# EAGLE design HeadsetR1 (EAGLE 6.4)
ECE477 Senior Design Project Augmented Reality Simulator board utilizing STM32F4 and Raspberry PI
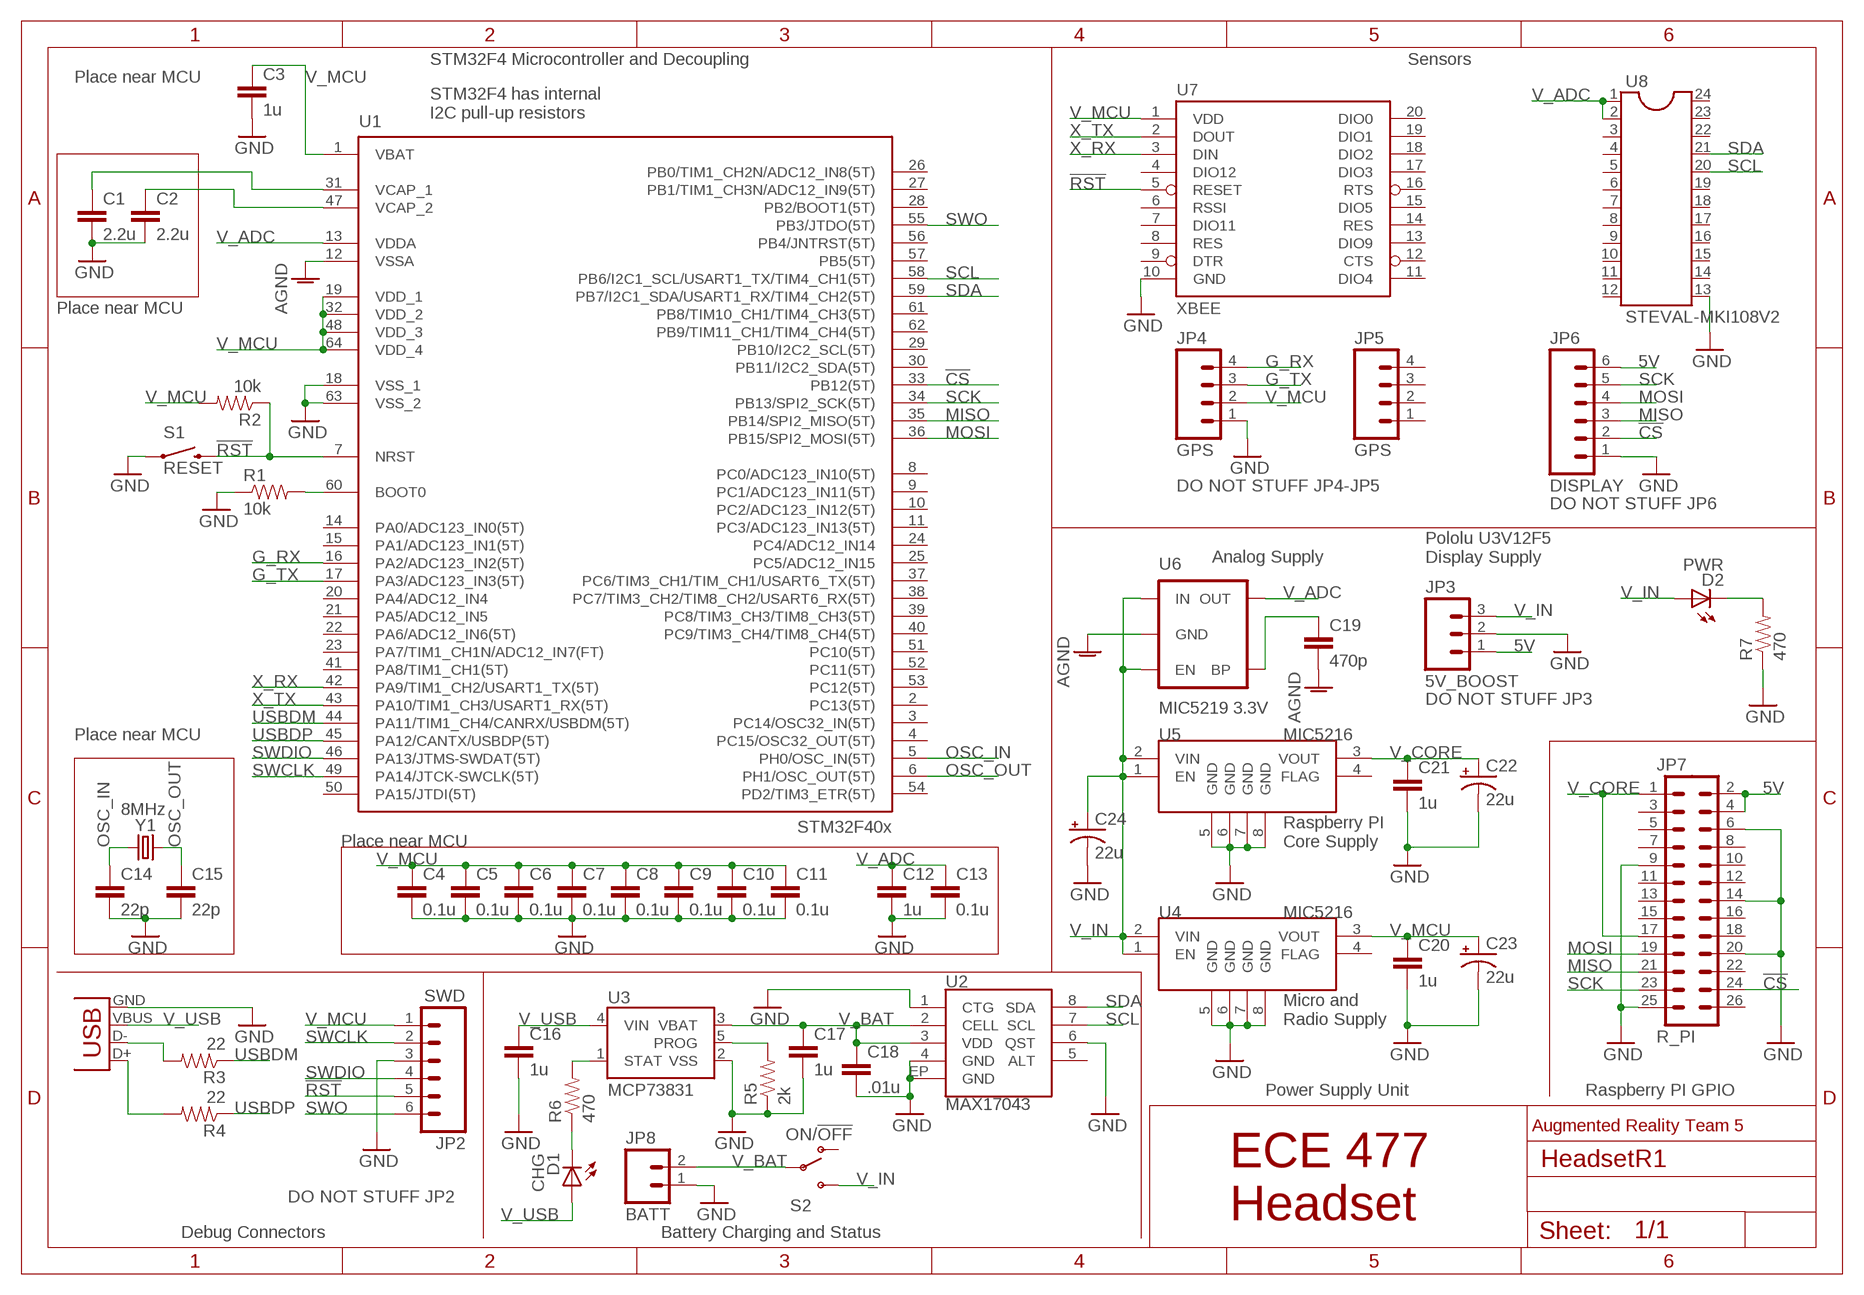
[diagram p0: schematic, sheet 1]

## Parts
C1  2.2u  CAP0805  [0805]
C2  2.2u  CAP0805  [0805]
C3  1u  CAP0805  [0805]
C4  0.1u  CAP0805  [0805]
C5  0.1u  CAP0805  [0805]
C6  0.1u  CAP0805  [0805]
C7  0.1u  CAP0805  [0805]
C8  0.1u  CAP0805  [0805]
C9  0.1u  CAP0805  [0805]
C10  0.1u  CAP0805  [0805]
C11  0.1u  CAP0805  [0805]
C12  1u  CAP0805  [0805]
C13  0.1u  CAP0805  [0805]
C14  22p  CAP0805  [0805]
C15  22p  CAP0805  [0805]
C16  1u  CAP0805  [0805]
C17  1u  CAP0805  [0805]
C18  .01u  CAP0805  [0805]
C19  470p  CAP0805  [0805]
C20  1u  CAP0805  [0805]
C21  1u  CAP0805  [0805]
C22  22u  CAP_POLVISHAY_D  [VISHAY_D]
C23  22u  CAP_POLVISHAY_D  [VISHAY_D]
C24  22u  CAP_POLVISHAY_D  [VISHAY_D]
D1  CHG  LED-RED1206  [LED-1206]
D2  PWR  LED-RED1206  [LED-1206]
JP1  USBSMD  [USB-MINIB]
JP2  SWD  M06SIP  [1X06]
JP3  5V_BOOST  M03PTH  [1X03]
JP4  GPS  M04PTH  [1X04]
JP5  GPS  M04PTH  [1X04]
JP6  DISPLAY  M06SIP  [1X06]
JP7  R_PI  M13X22X13  [2X13]
JP8  BATT  M02JST-PTH-2  [JST-2-PTH]
R1  10k  RES  [0805]
R2  10k  RES  [0805]
R3  22  RES  [0805]
R4  22  RES  [0805]
R5  2k  RES  [0805]
R6  470  RES  [0805]
R7  470  RES  [0805]
S1  RESET  SWITCH-MOMENTARY-2PTH  [TACTILE-PTH]
S2  ON/!OFF!  SWITCH-SPDTPTH  [SWITCH-SPDT]
U1  STM32F405RGT6  STM32F405R  [TQFP64]
U2  MAX17043  MAX1704X  [TDFN-8]
U3  MCP73831  [SOT23-5]
U4  MIC5216  V_REG_MIC5216  [MSOP8]
U5  MIC5216  V_REG_MIC5216  [MSOP8]
U6  MIC5219 3.3V  V_REG_MIC52193.3V  [SOT23-5]
U7  XBEE  XBEE-1B1  [XBEE-1]
U8  STEVAL-MKI108V2  DIL24-6  [DIL24-6]
Y1  8MHz  CRYSTALSMD  [HC49UP]

## Nets
5V: JP3.1 JP6.6 JP7.2 JP7.4
!CS!: JP6.2 JP7.24 U1.33(PB12(5T))
!RST!: JP2.5 R2.1 S1.3 U1.7(NRST) U7.5(RESET)
AGND: C19.2 U1.12(VSSA) U6.2(GND)
BC_PROG: R5.2 U3.5(PROG)
BC_STAT: R6.2 U3.1(STAT)
BC_STAT_LED: D1.C R6.1
BOOT0: R1.2 U1.60(BOOT0)
G_RX: JP4.4 U1.16(PA2/ADC123_IN2(5T))
G_TX: JP4.3 U1.17(PA3/ADC123_IN3(5T))
GND: C1.2 C2.2 C3.2 C4.2 C5.2 C6.2 C7.2 C8.2 C9.2 C10.2 C11.2 C12.2 C13.2 C14.2 C15.2 C16.2 C17.2 C18.2 C20.2 C21.2 C22.- C23.- C24.- JP1.GND JP2.3 JP3.2 JP4.1 JP6.1 JP7.6 JP7.9 JP7.14 JP7.20 JP7.25 JP8.1 R1.1 R5.1 R7.1 S1.1 U1.18(VSS_1) U1.63(VSS_2) U2.1(CTG) U2.4(GND) U2.6(QST) U2.EP(GND) U3.2(VSS) U4.5(GND) U4.6(GND) U4.7(GND) U4.8(GND) U5.5(GND) U5.6(GND) U5.7(GND) U5.8(GND) U7.10(GND) U8.13
MISO: JP6.3 JP7.21 U1.35(PB14/SPI2_MISO(5T))
MOSI: JP6.4 JP7.19 U1.36(PB15/SPI2_MOSI(5T))
OSC_IN: C14.1 U1.5(PH0/OSC_IN(5T)) Y1.1
OSC_OUT: C15.1 U1.6(PH1/OSC_OUT(5T)) Y1.2
PWR_LED: D2.C R7.2
SCK: JP6.5 JP7.23 U1.34(PB13/SPI2_SCK(5T))
SCL: U1.58(PB6/I2C1_SCL/USART1_TX/TIM4_CH1(5T)) U2.7(SCL) U8.20
SDA: U1.59(PB7/I2C1_SDA/USART1_RX/TIM4_CH2(5T)) U2.8(SDA) U8.21
SWCLK: JP2.2 U1.49(PA14/JTCK-SWCLK(5T))
SWDIO: JP2.4 U1.46(PA13/JTMS-SWDAT(5T))
SWO: JP2.6 U1.55(PB3/JTDO(5T))
USB_D+: JP1.D+ R4.2
USB_D-: JP1.D- R3.2
USBDM: R3.1 U1.44(PA11/TIM1_CH4/CANRX/USBDM(5T))
USBDP: R4.1 U1.45(PA12/CANTX/USBDP(5T))
V_ADC: C12.1 C13.1 U1.13(VDDA) U6.5(OUT) U8.1 U8.2
V_BAT: C17.1 C18.1 JP8.2 S2.2(P) U2.2(CELL) U2.3(VDD) U3.3(VBAT)
V_BYP: C19.1 U6.4(BP)
V_CORE: C21.1 C22.+ JP7.1 JP7.17 U5.3(VOUT)
V_IN: C24.+ D2.A JP3.3 S2.3(S) U4.1(EN) U4.2(VIN) U5.1(EN) U5.2(VIN) U6.1(IN) U6.3(EN)
V_MCU: C3.1 C4.1 C5.1 C6.1 C7.1 C8.1 C9.1 C10.1 C11.1 C20.1 C23.+ JP2.1 JP4.2 R2.2 U1.1(VBAT) U1.19(VDD_1) U1.32(VDD_2) U1.48(VDD_3) U1.64(VDD_4) U4.3(VOUT) U7.1(VDD)
V_USB: C16.1 D1.A JP1.VBUS U3.4(VIN)
VCAP1: C1.1 U1.31(VCAP_1)
VCAP2: C2.1 U1.47(VCAP_2)
X_RX: U1.42(PA9/TIM1_CH2/USART1_TX(5T)) U7.3(DIN)
X_TX: U1.43(PA10/TIM1_CH3/USART1_RX(5T)) U7.2(DOUT)
Unconnected: JP5.1 JP5.2 JP5.3 JP5.4 JP7.3 JP7.5 JP7.7 JP7.8 JP7.10 JP7.11 JP7.12 JP7.13 JP7.15 JP7.16 JP7.18 JP7.22 JP7.26 S2.1(O) U1.2(PC13(5T)) U1.3(PC14/OSC32_IN(5T)) U1.4(PC15/OSC32_OUT(5T)) U1.8(PC0/ADC123_IN10(5T)) U1.9(PC1/ADC123_IN11(5T)) U1.10(PC2/ADC123_IN12(5T)) U1.11(PC3/ADC123_IN13(5T)) U1.14(PA0/ADC123_IN0(5T)) U1.15(PA1/ADC123_IN1(5T)) U1.20(PA4/ADC12_IN4) U1.21(PA5/ADC12_IN5) U1.22(PA6/ADC12_IN6(5T)) U1.23(PA7/TIM1_CH1N/ADC12_IN7(FT)) U1.24(PC4/ADC12_IN14) U1.25(PC5/ADC12_IN15) U1.26(PB0/TIM1_CH2N/ADC12_IN8(5T)) U1.27(PB1/TIM1_CH3N/ADC12_IN9(5T)) U1.28(PB2/BOOT1(5T)) U1.29(PB10/I2C2_SCL(5T)) U1.30(PB11/I2C2_SDA(5T)) U1.37(PC6/TIM3_CH1/TIM_CH1/USART6_TX(5T)) U1.38(PC7/TIM3_CH2/TIM8_CH2/USART6_RX(5T)) U1.39(PC8/TIM3_CH3/TIM8_CH3(5T)) U1.40(PC9/TIM3_CH4/TIM8_CH4(5T)) U1.41(PA8/TIM1_CH1(5T)) U1.50(PA15/JTDI(5T)) U1.51(PC10(5T)) U1.52(PC11(5T)) U1.53(PC12(5T)) U1.54(PD2/TIM3_ETR(5T)) U1.56(PB4/JNTRST(5T)) U1.57(PB5(5T)) U1.61(PB8/TIM10_CH1/TIM4_CH3(5T)) U1.62(PB9/TIM11_CH1/TIM4_CH4(5T)) U2.5(ALT) U4.4(FLAG) U5.4(FLAG) U7.4(DIO12) U7.6(RSSI) U7.7(DIO11) U7.8(RES) U7.9(DTR) U7.11(DIO4) U7.12(CTS) U7.13(DIO9) U7.14(RES) U7.15(DIO5) U7.16(RTS) U7.17(DIO3) U7.18(DIO2) U7.19(DIO1) U7.20(DIO0) U8.3 U8.4 U8.5 U8.6 U8.7 U8.8 U8.9 U8.10 U8.11 U8.12 U8.14 U8.15 U8.16 U8.17 U8.18 U8.19 U8.22 U8.23 U8.24

## Notes on the sheet
- STM32F4 Microcontroller and Decoupling | Sensors
- Place near MCU
- STM32F4 has internal
  I2C pull-up resistors
- Place near MCU
- DO NOT STUFF JP4-JP5
- DO NOT STUFF JP6
- Analog Supply
- Pololu U3V12F5
  Display Supply
- DO NOT STUFF JP3
- Place near MCU
- Place near MCU
- Raspberry PI
  Core Supply
- Micro and
  Radio Supply
- Power Supply Unit | Raspberry PI GPIO
- Augmented Reality Team 5
- DO NOT STUFF JP2
- ECE 477
  Headset
- Debug Connectors | Battery Charging and Status

## Library data of the parts
C1-C21 = ECE477:CAP: Capacitor Standard 0603 ceramic capacitor, and 0.1" leaded capacitor.
C22-C24 = ECE477:CAP_POL: Capacitor Polarized SMD polarized capacitors
D1 D2 = SparkFun-LED:LED-RED: Assorted Red LEDs LilyPad 1206- DIO-09912 1206- DIO-00809 0603- DIO-00819; PROD_ID: DIO-00809; VALUE: RED
JP1 = SparkFun-Connectors:USB: USB Connectors USB-B-PTH is fully proven SKU : PRT-00139/CONN-08278 USB-miniB is fully proven SKU : PRT-00587 USB-A-PCB is untested. USB-A-H is throughly reviewed, but untested. Spark Fun Electronics SKU : PRT-00437 USB-B-SMT is throughly reviewed, but untested. Needs silkscreen touching up. USB-A-S has not been used/tested USB-MB-H has not been used/tested USB-MICROB has been used. CONN-09505
JP2 JP6 = SparkFun-Connectors:M06: Header 6 Standard 6-pin 0.1" header. Use with straight break away headers (SKU : PRT-00116), right angle break away headers (PRT-00553), swiss pins (PRT-00743), machine pins (PRT-00117), and female headers (PRT-00115). Molex polarized connector foot print use with SKU : PRT-08094 with associated crimp pins and housings. NOTES ON THE VARIANTS LOCK and LOCK_LONGPADS... This footprint was designed to help hold the alignment of a through-hole component (i.e. 6-pin header) while soldering it into place. You may notice that each hole has been shifted either up or down by 0.005 of an inch from it's more standard position (which is a perfectly straight line). This slight alteration caused the pins (the squares in the middle) to touch the edges of the holes. Because they are alternating, it causes a "brace" to hold the component in place. 0.005 has proven to be the perfect amount of "off-center" position when using our standard breakaway headers. Although looks a little odd when you look at the bare footprint, once you have a header in there, the alteration is very hard to notice. Also, if you push a header all the way into place, it is covered up entirely on the bottom side. This idea of altering the position of holes to aid alignment will be further integrated into the Sparkfun Library for other footprints. It can help hold any component with 3 or more connection pins.
JP3 = SparkFun-Connectors:M03: Header 3 Standard 3-pin 0.1" header. Use with straight break away headers (SKU : PRT-00116), right angle break away headers (PRT-00553), swiss pins (PRT-00743), machine pins (PRT-00117), and female headers (PRT-00115). Molex polarized connector foot print use with SKU : PRT-08232 with associated crimp pins and housings.
JP4 JP5 = SparkFun-Connectors:M04: Header 4 Standard 4-pin 0.1" header. Use with straight break away headers (SKU : PRT-00116), right angle break away headers (PRT-00553), swiss pins (PRT-00743), machine pins (PRT-00117), and female headers (PRT-00115). Molex polarized connector foot print use with SKU : PRT-08231 with associated crimp pins and housings. 1MM SMD Version SKU: PRT-10208
JP7 = SparkFun-Connectors:M13X2: 0.1" spaced headers
JP8 = SparkFun-Connectors:M02: Header 2 Standard 2-pin 0.1" header. Use with straight break away headers (SKU : PRT-00116), right angle break away headers (PRT-00553), swiss pins (PRT-00743), machine pins (PRT-00117), and female headers (PRT-00115). Molex polarized connector foot print use with SKU : PRT-08233 with associated crimp pins and housings.
R1-R7 = ECE477:RES: RESISTOR Surface-mount resistors
S1 = SparkFun-Electromechanical:SWITCH-MOMENTARY-2: Various NO switches- pushbuttons, reed, etc
S2 = SparkFun-Electromechanical:SWITCH-SPDT: SPDT Switch Simple slide switch, Spark Fun Electronics SKU : COM-00102 DPDT SMT slide switch, AYZ0202, SWCH-08179
U1 = ECE477:STM32F405R: STM32F405 64 pin LQFP reviewed: YES tested: YES
U2 = SparkFun-PowerIC:MAX1704X: MAX17043/MAX17044: Battery Fuel Guage (43 is 1cell, 44 is 2cell)
U3 = SparkFun-PowerIC:MCP73831: Miniature single cell, fully integrated Li-Ion, Li-polymer charge management controller http://ww1.microchip.com/downloads/en/DeviceDoc/21984a.pdf IC-09995; PROD_ID: IC-09995
U4 U5 = SparkFun-PowerIC:V_REG_MIC5216: 500mA LDO, MSOP8 for better dissipation
U6 = SparkFun-PowerIC:V_REG_MIC5219: V_REG MIC5219 Standard 500mA LDO voltage regulator in SOT-23 layout. Micrel part MIC5219. BP (by-pass) pin is used to lower output noise with 470pF cap, may be left open.; PROD_ID: VREG-09872
U7 = SparkFun-RF:XBEE-1: Xbee module footprints SMT header is CONN-09042.
U8 = ic-package:DIL24: Dual In Line
Y1 = SparkFun-FreqCtrl:CRYSTAL: Various standard crystals. Proven footprints. Spark Fun Electronics SKU : COM-00534

## Board
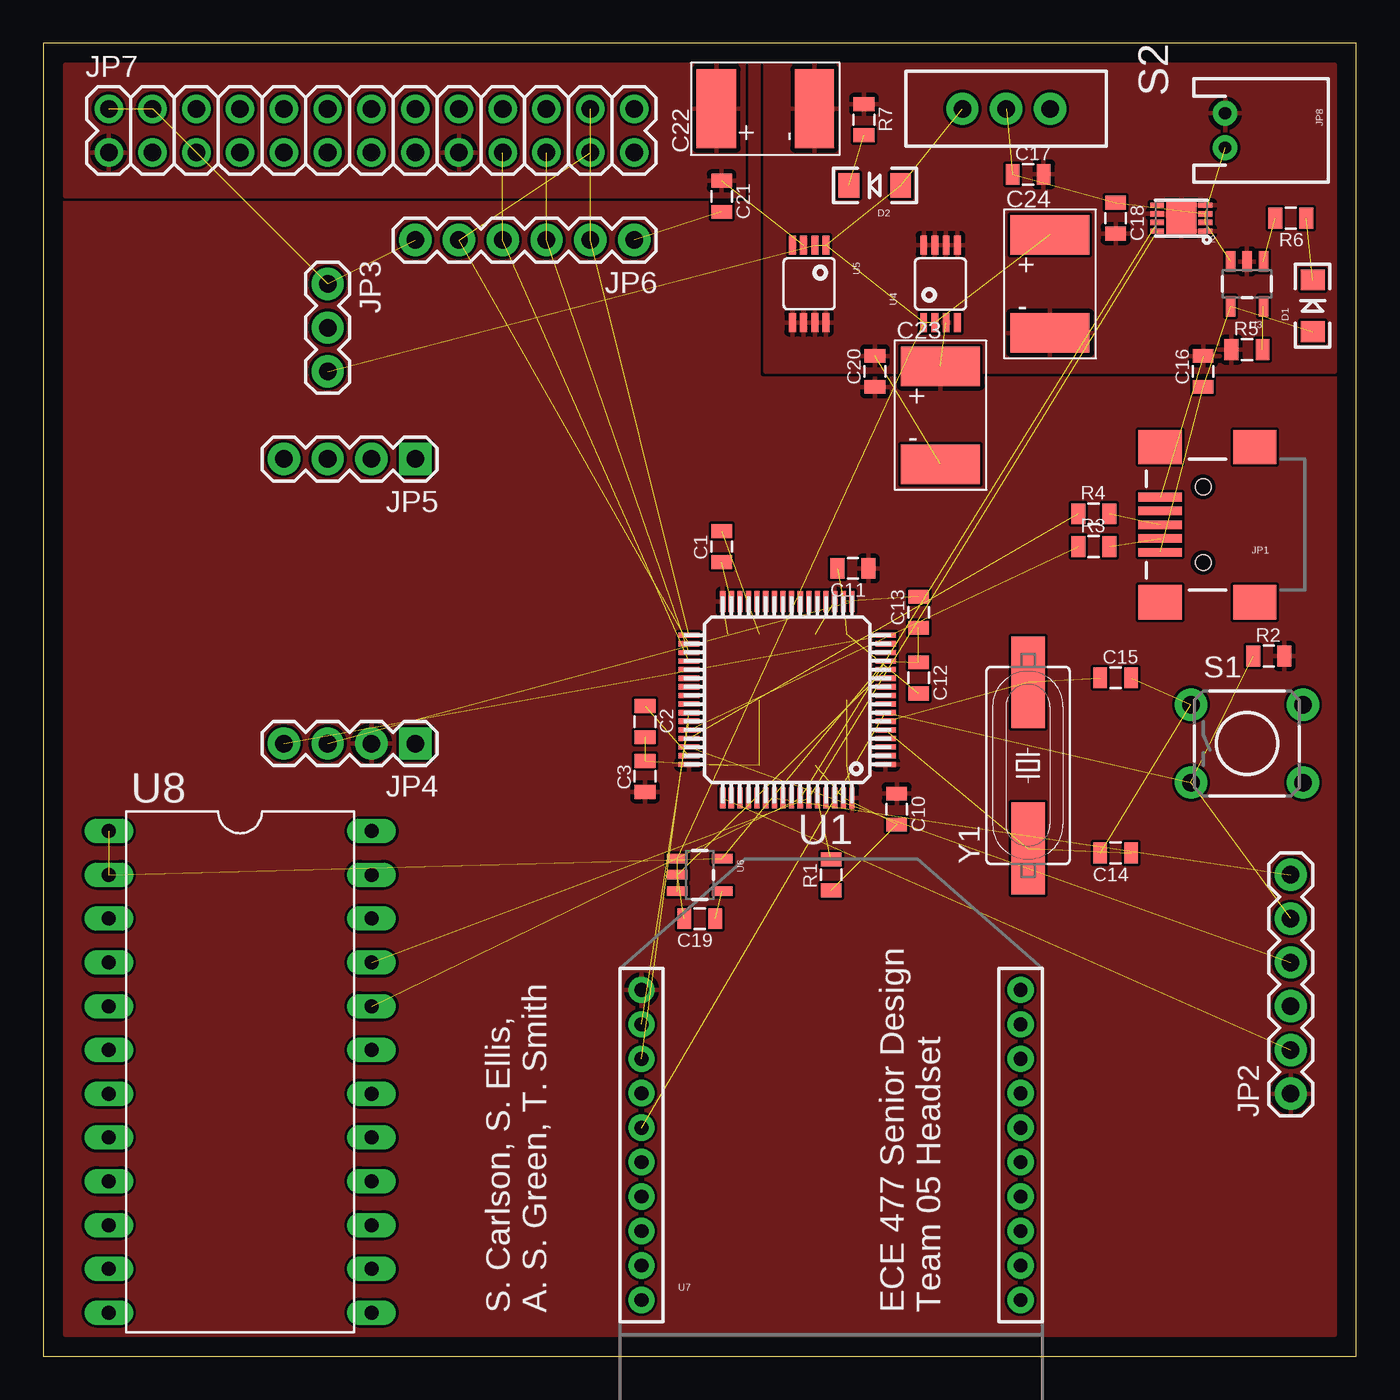
[diagram p1: board, top side]
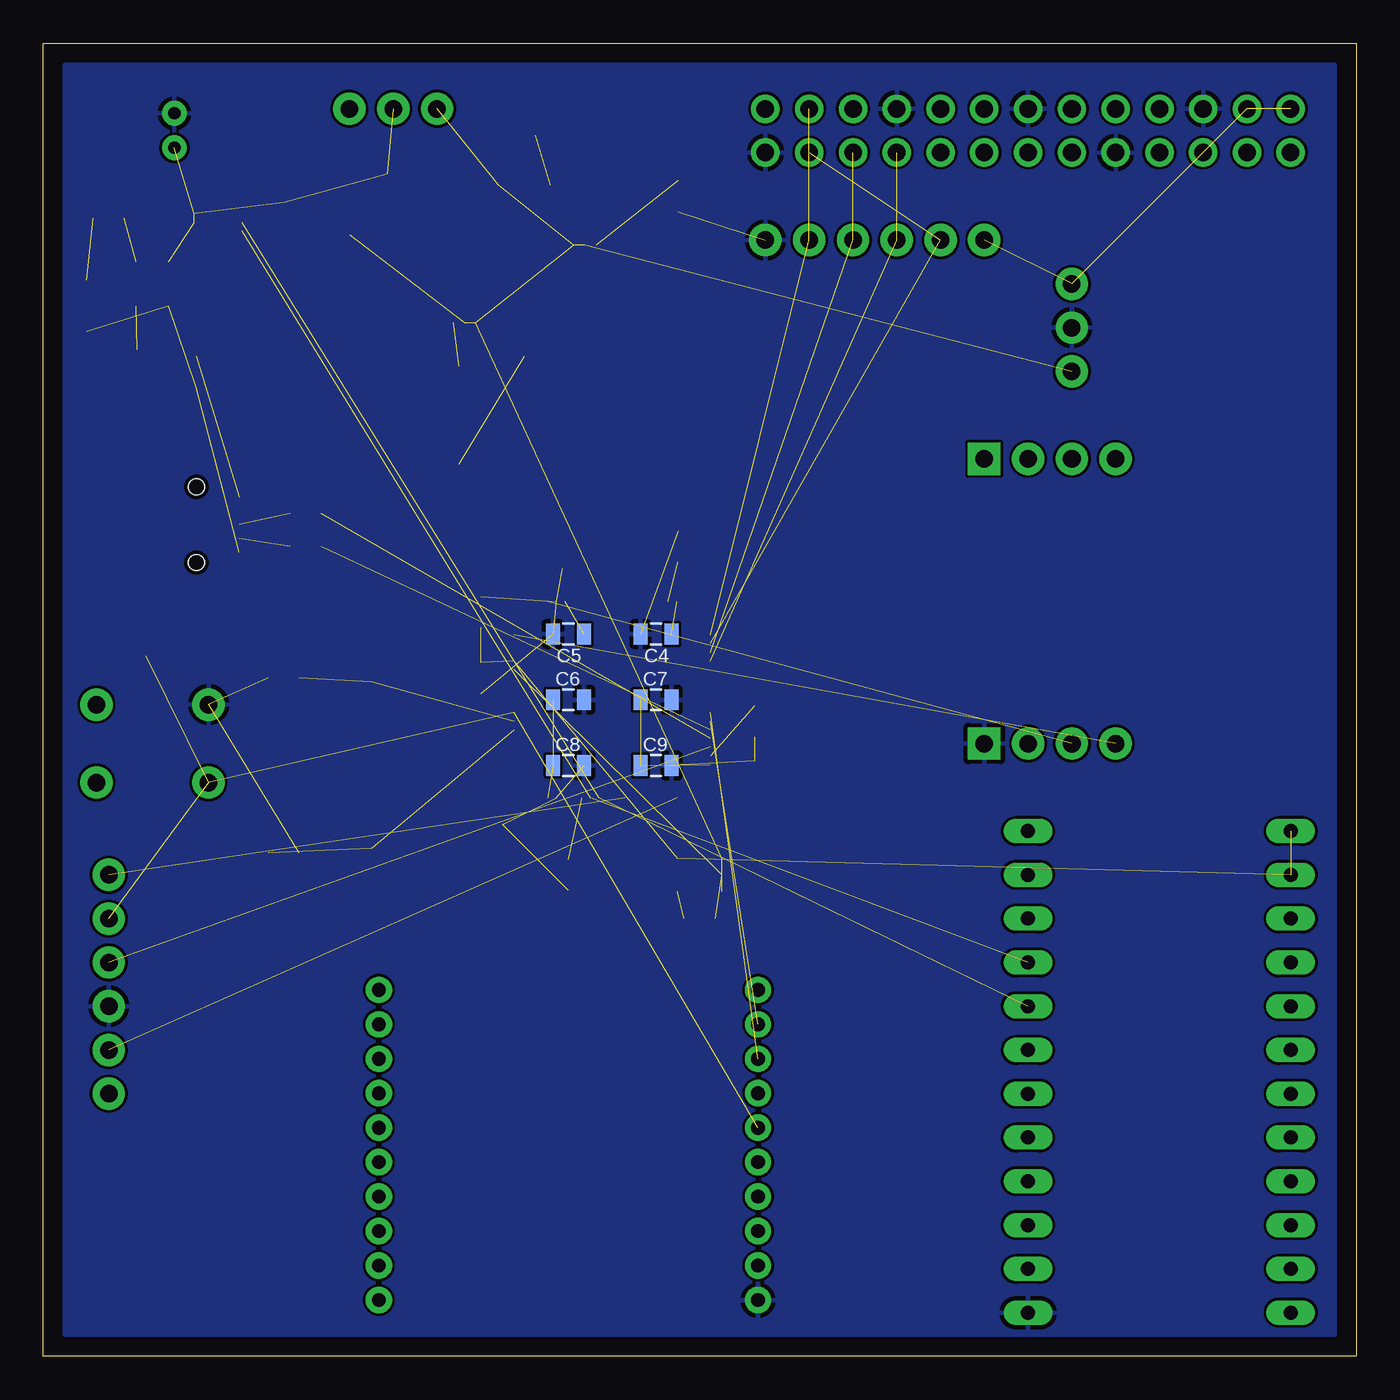
[diagram p2: board, bottom side, seen from below]

Size 76.2 x 76.2 mm. Coordinates in mm from the lower left corner, seen from the top.
Outline: 0,0 76.2,0 76.2,76.2 0,76.2 0,0
Copper layers (1*16): Top 0.035mm / dielectric 1.5mm / Bottom 0.035mm
Design rules "SparkFun *": minimum track width 8mil, minimum drill 20mil, track to track 6mil, track to pad 6mil, pad to pad 6mil, via to via 6mil, smd to smd 6mil, copper to edge 10mil, drill to drill 8mil, minimum pad ring 12mil, minimum via ring 10mil, stop-mask expansion 4mil, vias tented up to drill 25mil, thermal gap 10mil

### Footprints (pad centres in the part's own frame; a part is rotated, then mirrored left to right if it is on the bottom)
0805 = smd 0.8 x 1.2: 1 -0.9,0; 2 0.9,0
VISHAY_D = smd 4.572 x 2.286: + 0,2.845; - 0,-2.845
LED-1206 = smd 1.2 x 1.4: A -1.5,0; C 1.5,0
USB-MINIB = smd 2.5 x 0.5: D+ 2.5,0; D- 2.5,0.8; GND 2.5,-1.6; ID 2.5,-0.8; VBUS 2.5,1.6 | smd 2.5 x 2: MTN1 -3,4.5; MTN2 2.5,4.5; MTN3 -3,-4.5; MTN4 2.5,-4.5 | hole 0.9: 0,2.2; 0,-2.2
1X06 = drill 1.016 pad 1.88: 1 0,0; 2 2.54,0; 3 5.08,0; 4 7.62,0; 5 10.16,0; 6 12.7,0
1X03 = drill 1.016 pad 1.88: 1 0,0; 2 2.54,0; 3 5.08,0
1X04 = drill 1.016 pad 1.88 square: 1 0,0 | drill 1.016 pad 1.88: 2 2.54,0; 3 5.08,0; 4 7.62,0
2X13 = drill 1.016 pad 1.651: 1 0,0; 2 0,2.54; 3 2.54,0; 4 2.54,2.54; 5 5.08,0; 6 5.08,2.54; 7 7.62,0; 8 7.62,2.54; 9 10.16,0; 10 10.16,2.54; 11 12.7,0; 12 12.7,2.54; 13 15.24,0; 14 15.24,2.54; 15 17.78,0; 16 17.78,2.54; 17 20.32,0; 18 20.32,2.54; 19 22.86,0; 20 22.86,2.54; 21 25.4,0; 22 25.4,2.54; 23 27.94,0; 24 27.94,2.54; 25 30.48,0; 26 30.48,2.54
JST-2-PTH = drill 0.7 pad 1.448: 1 -1,0; 2 1,0
TACTILE-PTH = drill 1.016 pad 1.88: 1 -3.251,2.261; 2 3.251,2.261; 3 -3.251,-2.261; 4 3.251,-2.261
SWITCH-SPDT = drill 1.016 pad 1.88: 1 0,2.54; 2 0,0; 3 0,-2.54
TQFP64 = smd 1.2 x 0.3: 1 -5.7,3.75; 2 -5.7,3.25; 3 -5.7,2.75; 4 -5.7,2.25; 5 -5.7,1.75; 6 -5.7,1.25; 7 -5.7,0.75; 8 -5.7,0.25; 9 -5.7,-0.25; 10 -5.7,-0.75; 11 -5.7,-1.25; 12 -5.7,-1.75; 13 -5.7,-2.25; 14 -5.7,-2.75; 15 -5.7,-3.25; 16 -5.7,-3.75; 33 5.7,-3.75; 34 5.7,-3.25; 35 5.7,-2.75; 36 5.7,-2.25; 37 5.7,-1.75; 38 5.7,-1.25; 39 5.7,-0.75; 40 5.7,-0.25; 41 5.7,0.25; 42 5.7,0.75; 43 5.7,1.25; 44 5.7,1.75; 45 5.7,2.25; 46 5.7,2.75; 47 5.7,3.25; 48 5.7,3.75 | smd 0.3 x 1.2: 17 -3.75,-5.7; 18 -3.25,-5.7; 19 -2.75,-5.7; 20 -2.25,-5.7; 21 -1.75,-5.7; 22 -1.25,-5.7; 23 -0.75,-5.7; 24 -0.25,-5.7; 25 0.25,-5.7; 26 0.75,-5.7; 27 1.25,-5.7; 28 1.75,-5.7; 29 2.25,-5.7; 30 2.75,-5.7; 31 3.25,-5.7; 32 3.75,-5.7; 49 3.75,5.7; 50 3.25,5.7; 51 2.75,5.7; 52 2.25,5.7; 53 1.75,5.7; 54 1.25,5.7; 55 0.75,5.7; 56 0.25,5.7; 57 -0.25,5.7; 58 -0.75,5.7; 59 -1.25,5.7; 60 -1.75,5.7; 61 -2.25,5.7; 62 -2.75,5.7; 63 -3.25,5.7; 64 -3.75,5.7
TDFN-8 = smd 0.8 x 0.3: 1 -1.4,0.75; 2 -1.4,0.25; 3 -1.4,-0.25; 4 -1.4,-0.75; 5 1.4,-0.75; 6 1.4,-0.25; 7 1.4,0.25; 8 1.4,0.75 | smd 1.73 x 1.88: EP 0,0
SOT23-5 = smd 0.55 x 1.2: 1 -0.95,-1.3; 2 0,-1.3; 3 0.95,-1.3; 4 0.95,1.3; 5 -0.95,1.3
MSOP8 = smd 0.4 x 1.1: 1 -0.975,-2.25; 2 -0.325,-2.25; 3 0.325,-2.25; 4 0.975,-2.25; 5 0.975,2.25; 6 0.325,2.25; 7 -0.325,2.25; 8 -0.975,2.25
XBEE-1 = drill 0.8 pad 1.524: 1 -11,20; 2 -11,18; 3 -11,16; 4 -11,14; 5 -11,12; 6 -11,10; 7 -11,8; 8 -11,6; 9 -11,4; 10 -11,2; 11 11,2; 12 11,4; 13 11,6; 14 11,8; 15 11,10; 16 11,12; 17 11,14; 18 11,16; 19 11,18; 20 11,20
DIL24-6 = drill 0.813 long: 1 -13.97,-7.62; 2 -11.43,-7.62; 3 -8.89,-7.62; 4 -6.35,-7.62; 5 -3.81,-7.62; 6 -1.27,-7.62; 7 1.27,-7.62; 8 3.81,-7.62; 9 6.35,-7.62; 10 8.89,-7.62; 11 11.43,-7.62; 12 13.97,-7.62; 13 13.97,7.62; 14 11.43,7.62; 15 8.89,7.62; 16 6.35,7.62; 17 3.81,7.62; 18 1.27,7.62; 19 -1.27,7.62; 20 -3.81,7.62; 21 -6.35,7.62; 22 -8.89,7.62; 23 -11.43,7.62; 24 -13.97,7.62
HC49UP = smd 5.334 x 1.93: 1 -4.826,0; 2 4.826,0

### Placement (x,y rotation side)
C1  39.37,46.99 90 top
C2  34.92,36.83 270 top
C3  34.92,33.66 90 top
C4  40.64,41.91 180 bottom
C5  45.72,41.91 180 bottom
C6  45.72,38.1 0 bottom
C7  40.64,38.1 0 bottom
C8  45.72,34.29 0 bottom
C9  40.64,34.29 0 bottom
C10  49.53,31.75 270 top
C11  46.99,45.72 180 top
C12  50.8,39.37 270 top
C13  50.8,43.18 90 top
C14  62.23,29.21 180 top
C15  62.23,39.37 0 top
C16  67.31,57.15 90 top
C17  57.15,68.58 0 top
C18  62.23,66.04 270 top
C19  38.1,25.4 180 top
C20  48.26,57.15 90 top
C21  39.37,67.31 270 top
C22  41.91,72.39 90 top
C23  52.07,54.61 0 top
C24  58.42,62.23 0 top
D1  73.66,60.96 90 top
D2  48.26,67.94 180 top
JP1  67.31,48.26 180 top
JP2  72.39,15.24 90 top
JP3  16.51,62.23 270 top
JP4  21.59,35.56 180 top
JP5  21.59,52.07 180 top
JP6  34.29,64.77 180 top
JP7  3.81,69.85 0 top
JP8  68.58,71.12 270 top
R1  45.72,27.94 90 top
R2  71.12,40.64 0 top
R3  60.96,46.99 0 top
R4  60.96,48.9 0 top
R5  69.85,58.42 0 top
R6  72.39,66.04 180 top
R7  47.62,71.75 270 top
S1  69.85,35.56 0 top
S2  55.88,72.39 270 top
U1  43.18,38.1 180 top
U2  66.04,66.04 180 top
U3  69.85,62.23 180 top
U4  52.07,62.23 0 top
U5  44.45,62.23 180 top
U6  38.1,27.94 270 top
U7  45.72,1.27 0 top
U8  11.43,16.51 270 top
Y1  57.15,34.29 90 top

### Tracks (layer width: path | path; a pad name or v marks a point on that pad's centre or on a via)
5V  (3 unrouted)
!CS!  (2 unrouted)
!RST!  (4 unrouted)
AGND  (2 unrouted)
BC_PROG  (1 unrouted)
BC_STAT  (1 unrouted)
BC_STAT_LED  (1 unrouted)
BOOT0  (1 unrouted)
G_RX  (1 unrouted)
G_TX  (1 unrouted)
GND  (15 unrouted)
  pour Bottom (rank 5): 1.27,74.93 1.27,1.27 74.93,1.27 74.93,74.93
  pour Top (rank 3): 41.91,74.93 41.91,57.15 74.93,57.15 74.93,74.93
MISO  (2 unrouted)
MOSI  (2 unrouted)
OSC_IN  (2 unrouted)
OSC_OUT  (2 unrouted)
PWR_LED  (1 unrouted)
SCK  (2 unrouted)
SCL  (2 unrouted)
SDA  (2 unrouted)
SWCLK  (1 unrouted)
SWDIO  (1 unrouted)
SWO  (1 unrouted)
USB_D+  (1 unrouted)
USB_D-  (1 unrouted)
USBDM  (1 unrouted)
USBDP  (1 unrouted)
V_ADC  (5 unrouted)
V_BAT  (6 unrouted)
V_BYP  (1 unrouted)
V_CORE  (1 unrouted)
  pour Top (rank 2): 1.27,74.93 1.27,67.31 40.64,67.31 40.64,74.93
V_IN  (9 unrouted)
V_MCU  (7 unrouted)
  pour Top (rank 5): 1.27,74.93 1.27,1.27 74.93,1.27 74.93,74.93
V_USB  (3 unrouted)
VCAP1  (1 unrouted)
VCAP2  (1 unrouted)
X_RX  (1 unrouted)
X_TX  (1 unrouted)

### Text on the board
tPlace: S. Carlson, S. Ellis, / A. S. Green, T. Smith | ECE 477 Senior Design / Team 05 Headset